# Altium project eom_driver.PrjPcb
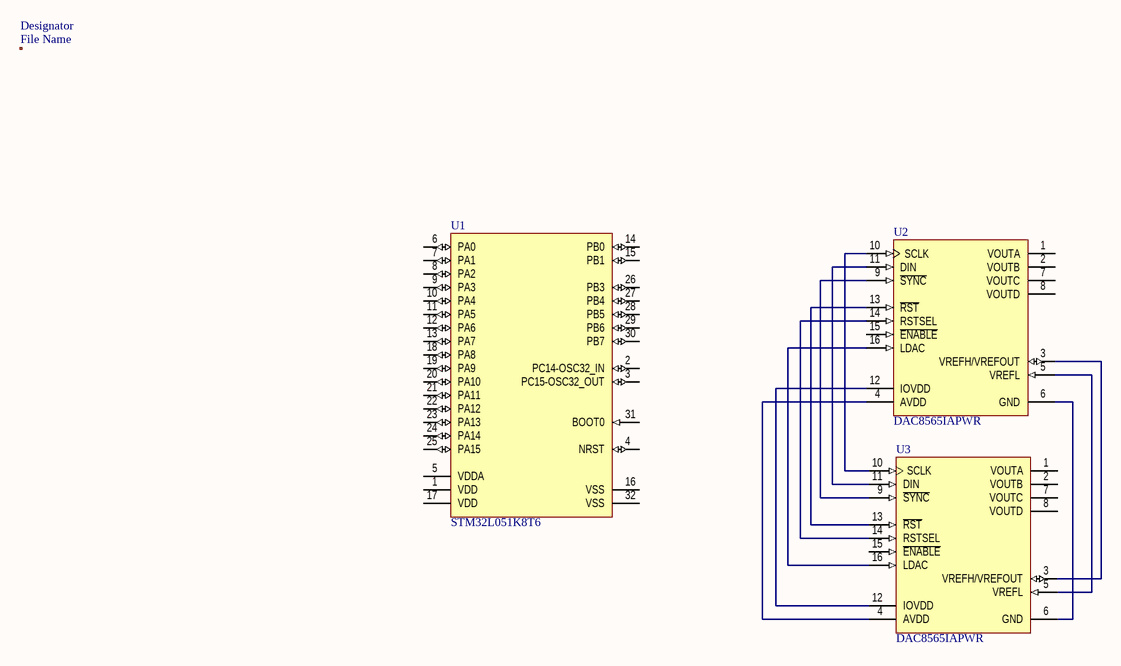
[diagram p0: top_level.SchDoc]
CAGE_CODE: ?????; CONTRACT_NUMBER: <CONTRACT NO>; DOC_NO_ASSY_DWG: <ASSY DWG NO>; DOC_NO_BOM: <BOM DOC NO>; DOC_NO_FAB_DWG: <FAB DWG NO>; DOC_NO_SCH_DWG: <SCH DWG NO>; PCB_2_DEC_TOL: +/-.01; PCB_3_DEC_TOL: +/-.010; PCB_ANG_TOL: +/-1/2; PCB_ASSEMBLY_NO: <PCB ASSY NO>; PCB_CHECKER: - -----; PCB_CHECKER_APP_DATE: --/--/----; PCB_DESIGNER: - -----; PCB_DESIGNER_APP_DATE: --/--/----; PCB_DWG_NO: <PCB DWG NO>; PCB_ENGINEER: - -----; PCB_ENGINEER_APP_DATE: --/--/----; PCB_PART_NUMBER: <PCB PN>; PCB_REV: A; SCH_REV: A
2 sheets, 9 parts. Net scope: flat (ports and power ports of the same name join across sheets).
Board file: PCB1.PcbDoc
Sheets:
  top_level.SchDoc
  output_buffer.SchDoc

## Sheet top_level.SchDoc
size 431 x 279 mm; SheetNumber: 1; SheetTotal: 2; ENG_APP_DATE: --/--/--; DSN_APP_DATE: --/--/--; CHK_APP_DATE: --/--/--

### Parts
U1  STM32L051K8T6  [STM-LQFP32_L]
U2  DAC8565IAPWR  [TI-PW16_L]
U3  DAC8565IAPWR  [TI-PW16_L]

### Sub-sheets
Designator = File Name (file not in this document): no entries

### Nets
NetU2_3: U2.3(VREFH/VREFOUT) U3.3(VREFH/VREFOUT)
NetU2_4: U2.4(AVDD) U3.4(AVDD)
NetU2_5: U2.5(VREFL) U3.5(VREFL)
NetU2_6: U2.6(GND) U3.6(GND)
NetU2_9: U2.9(~{SYNC}) U3.9(~{SYNC})
NetU2_10: U2.10(SCLK) U3.10(SCLK)
NetU2_11: U2.11(DIN) U3.11(DIN)
NetU2_12: U2.12(IOVDD) U3.12(IOVDD)
NetU2_13: U2.13(~{RST}) U3.13(~{RST})
NetU2_14: U2.14(RSTSEL) U3.14(RSTSEL)
NetU2_16: U2.16(LDAC) U3.16(LDAC)

Not connected (* = marked no-connect by the designer): U1 1(VDD) 2(PC14-OSC32_IN) 3(PC15-OSC32_OUT) 4(NRST) 5(VDDA) 6(PA0) 7(PA1) 8(PA2) 9(PA3) 10(PA4) 11(PA5) 12(PA6) 13(PA7) 14(PB0) 15(PB1) 16(VSS) 17(VDD) 18(PA8) 19(PA9) 20(PA10) 21(PA11) 22(PA12) 23(PA13) 24(PA14) 25(PA15) 26(PB3) 27(PB4) 28(PB5) 29(PB6) 30(PB7) 31(BOOT0) 32(VSS); U2 1(VOUTA) 2(VOUTB) 7(VOUTC) 8(VOUTD) 15(~{ENABLE}); U3 1(VOUTA) 2(VOUTB) 7(VOUTC) 8(VOUTD) 15(~{ENABLE})

### Notes on the sheet
- 8
- 7
- 6
- 5
- 4
- 3
- DWG. NO.
- REV.
- SHT.
- 2
- 1
- THIS DOCUMENT AND THE DATA DISCLOSED HEREIN OR HEREWITH IS THE PROPERTY OF ALTIUM LIMITED AND MAY BE FREELY DISTRIBUTED IN WHOLE. NO RIGHTS ARE RESERVED OR EXPRESS OR IMPLIED WARANTEE GIVEN.
- REVISION
- DESCRIPTION
- DATE
- APPROVED
- F
- E
- D
- C
- B
- ENG:
- APPROVALS
- PROJECT
- SUITE 200
- 2175 SALK AVENUE
- CARLSBAD, CA 92008
- A
- DSN:
- CHK:
- REFERENCE DOCUMENTS
- PROJECT REVISION:
- TITLE
- DOCUMENT REVISION:
- DESIGN ITEM:
- USA
- BOM:
- FAB DWG:
- PCB DWG:
- ASSY DWG:
- SCALE:
- SIZE
- CAGE CODE
- FILE NAME
- DWG NO.
- SHEET
- OF
- REV

### Library data of the parts
U1 = CMP-1546-00001-1: Ultra-Low-Power ARM Cortex-M0+ MCU, 64 KB Flash, 1.8 to 3.6 V, -40 to 85 degC, 32-Pin LQFP, RoHS, Tray; VDD Min: 1.8 V; VDD Max: 3.6 V; Flash: 64 KB; RAM: 8 KB; Data EEPROM: 2 KB; Packing: Tray; Mounting Technology: Surface Mount; ComponentLink2URL: http://www.st.com/st-web-ui/static/active/en/resource/technical/document/datasheet/DM00108219.pdf; RoHS: TRUE; PackageDescription: 32-Pin Low-Profile Quad Flat Package, Body 7 x 7 mm, Pitch 0.8 mm; Temperature Max: 85 degC; ComponentLink3URL: http://www.st.com/st-web-ui/static/active/en/resource/technical/document/datasheet/DM00108219.pdf; ComponentLink1URL: http://www.st.com/web/en/home.html; DatasheetVersion: Rev. 4; Temperature Min: -40 degC; ComponentLink2Description: Datasheet; ComponentLink3Description: Package Specification; ComponentLink1Description: Manufacturer URL; PartNumber: STM32L051K8T6
U2 U3 = CMP-0004-01139-1: 16-Bit, Quad Channel, Ultra-Low Glitch, Voltage Output DAC with 2.5 V, 2 ppm/degC Internal Reference, -40 to 105 degC, 16-pin SOP (PW16), Green (RoHS & no Sb/Br); Manufacturer: Texas Instruments; DAC Channels: 4; Power Consumption(Typ)(mW): 3.6; Settling Time(us): 8; DNL(Max)(+/-LSB): 1; SNR(dB): 90; Resolution(Bits): 16; SFDR(dB): 78; Interface: Serial SPI; SubFamily: Precision DAC (=<10MSPS); INL(Max)(+/-LSB): 12; ComponentLink3Description: Package Specification; PackageDescription: 16-Pin Plastic Small Outline, Body 5 x 4.4 mm, Pitch 0.65 mm; Mounting Technology: Surface Mount; PartNumber: DAC8565IAPWR; Code_JEDEC: MO-153; ComponentLink2URL: http://www.ti.com/general/docs/lit/getliterature.tsp?genericPartNumber=DAC8565&fileType=pdf; PackageVersion: 4040064-4/G, 02/2011; ComponentLink1Description: Manufacturer URL; Eco-Plan: Green (RoHS & no Sb/Br); DatasheetVersion: SBAS411C; ComponentLink2Description: Datasheet; PackageReference: PW16; ComponentLink3URL: http://www.ti.com/lit/ml/mpds361/mpds361.pdf; ComponentLink1URL: http://www.ti.com/

## Sheet output_buffer.SchDoc
size A; SheetNumber: 2; SheetTotal: 2
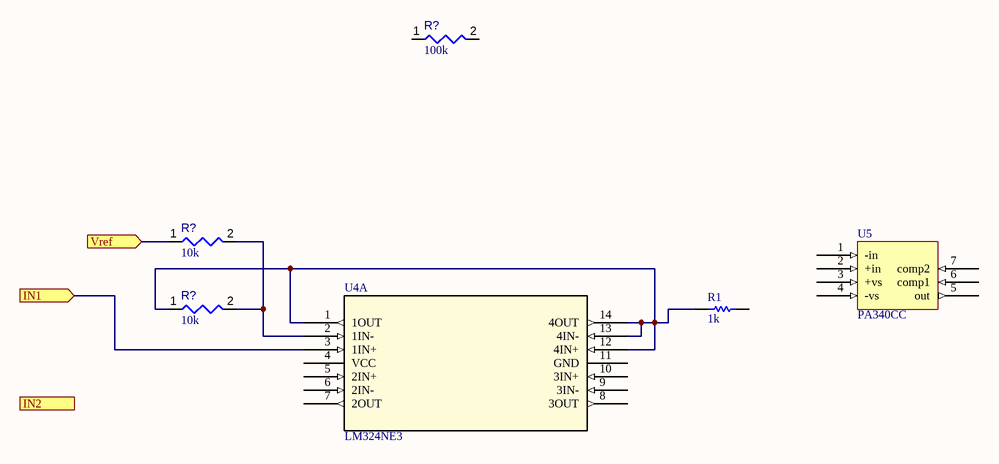
[diagram p1: output_buffer.SchDoc]

### Parts
(Parts that share a designator on the sheet are numbered #1, #2 ... from top to bottom, then left to right.)
R1  value 1k  [RESC2013X70X40ML20T20]  (hidden comment: Resistor 1k +/-1% 0805 125 mW)
R?#1  value 100k  [RESC2013X70X40ML20T20]  (hidden comment: Resistor 100k +/-1% 0805 125 mW)
R?#2  value 10k  [RESC2013X50X35ML15T15]  (hidden comment: Resistor 10k +/-1% 0805 125 mW)
R?#3  value 10k  [RESC2013X50X35ML15T15]  (hidden comment: Resistor 10k +/-1% 0805 125 mW)
U4  LM324NE3  [N14]  (part A of 2)
U5  PA340CC  [PA340CC-Footprint-1]

### Ports
IN1 (in), IN2 (in), Vref (in)

### Nets
NetR1_1: R1.1 R?#3.1 U4.1(1OUT) U4.12(4IN+) U4.13(4IN-) U4.14(4OUT)
NetR?#2_1: R?#2.1 ; port Vref
NetR?#2_2: R?#2.2 R?#3.2 U4.2(1IN-)
NetU4_3: U4.3(1IN+) ; port IN1

Not connected (* = marked no-connect by the designer): R1 2; R?#1 1 2; U4 4(VCC) 5(2IN+) 6(2IN-) 7(2OUT) 8(3OUT) 9(3IN-) 10(3IN+) 11(GND); U5 1(-in) 2(+in) 3(+vs) 4(-vs) 5(out) 6(comp1) 7(comp2)

### Library data of the parts
R1 = CMP-009-00010-4: Chip Resistor, 1 KOhm, +/- 1%, 0.125 W, -55 to 155 degC, 0805 (2013 Metric); Power: 125mW; Voltage Rating: 150V; Min Operating Temperature: -55°C; RoHS Compliant: True; Max Operating Temperature: 155°C; Case/Package: 0805; Pins: 2; Tolerance: 1%; Mounting Technology: SM
R?#1 = CMP-009-00024-4: Chip Resistor, 100 KOhm, +/- 1%, 0.125 W, -55 to 155 degC, 0805 (2012 Metric); Power: 125mW; Voltage Rating: 150V; Case/Package: 0805; Pins: 2; RoHS Compliant: True; Mounting Technology: SM; Tolerance: 1%; Max Operating Temperature: 155°C; Min Operating Temperature: -55°C
R?#2 R?#3 = CMP-009-00018-4: Chip Resistor, 10 KOhm, +/- 1%, 125 mW, -55 to 155 degC, 0805 (2012 Metric); Power: 125mW; Voltage Rating: 150V; RoHS Compliant: True; Mounting Technology: SM; Pins: 2; Case/Package: 0805; Min Operating Temperature: -55°C; Max Operating Temperature: 155°C; Tolerance: 1%
U4 = LM324NE3: No Description Available; Mfr_Name: Texas Instruments; Copyright: Copyright (C) 2022 Ultra Librarian. All rights reserved.; Manufacturer_Part_Number: LM324NE3; RefDes: RefDes; Type: DEV
U5 = CMP-014-00002-1